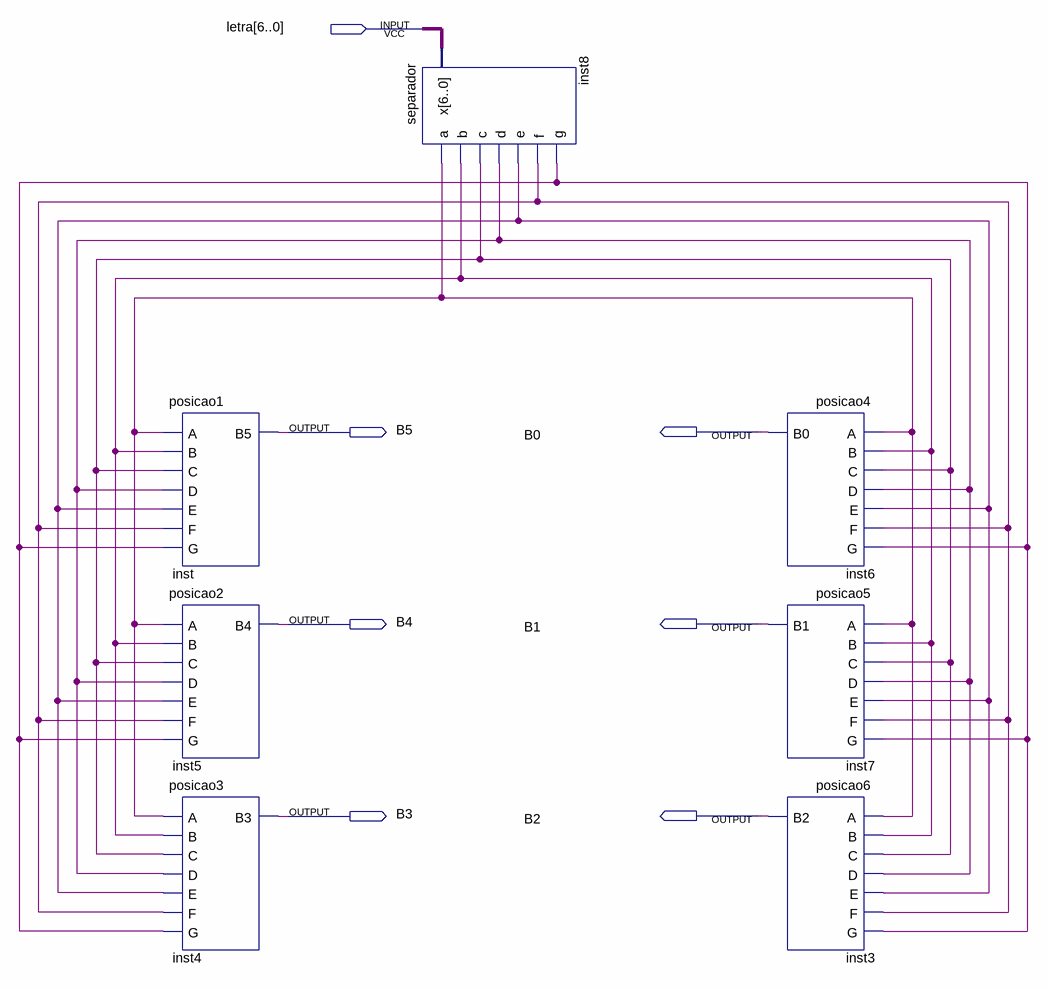
[diagram p0: schematic sheet]
// Quartus schematic Decodificador.bdf as structural Verilog: 7 symbols, 7 pins
module Decodificador (
  input  [6:0] letra,
  output B5,
  output B0,
  output B4,
  output B1,
  output B3,
  output B2
);

  wire inst8_a, inst8_b, inst8_c, inst8_d, inst8_e, inst8_f, inst8_g;

  posicao1 inst (.A(inst8_a), .B(inst8_b), .C(inst8_c), .D(inst8_d), .E(inst8_e), .F(inst8_f), .G(inst8_g), .B5(B5));
  posicao2 inst5 (.A(inst8_a), .B(inst8_b), .C(inst8_c), .D(inst8_d), .E(inst8_e), .F(inst8_f), .G(inst8_g), .B4(B4));
  posicao3 inst4 (.A(inst8_a), .B(inst8_b), .C(inst8_c), .D(inst8_d), .E(inst8_e), .F(inst8_f), .G(inst8_g), .B3(B3));
  separador inst8 (
    .x(letra), .a(inst8_a), .b(inst8_b), .c(inst8_c), .d(inst8_d), .e(inst8_e), .f(inst8_f), .g(inst8_g));
  posicao4 inst6 (.A(inst8_a), .B(inst8_b), .C(inst8_c), .D(inst8_d), .E(inst8_e), .F(inst8_f), .G(inst8_g), .B0(B0));
  posicao5 inst7 (.A(inst8_a), .B(inst8_b), .C(inst8_c), .D(inst8_d), .E(inst8_e), .F(inst8_f), .G(inst8_g), .B1(B1));
  posicao6 inst3 (.A(inst8_a), .B(inst8_b), .C(inst8_c), .D(inst8_d), .E(inst8_e), .F(inst8_f), .G(inst8_g), .B2(B2));
endmodule
